# EAGLE design BB-shield-adapter (EAGLE 7.5.0)
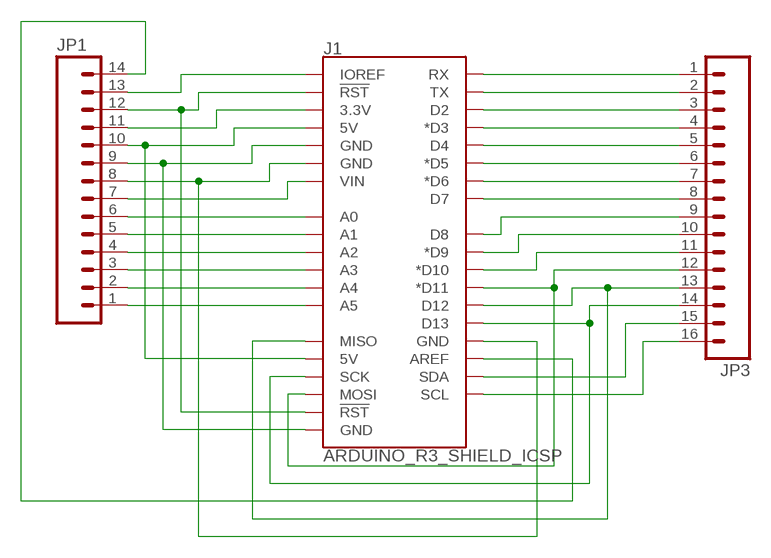
[diagram p0: schematic, sheet 1]

## Parts
J1  ARDUINO_R3_SHIELD_ICSP  [UNO_R3_SHIELD_ICSP]
JP1  M14  [1X14]
JP3  M16PTH  [1X16]

## Nets
N$1: J1.A5 JP1.1
N$2: J1.A4 JP1.2
N$3: J1.A3 JP1.3
N$4: J1.A2 JP1.4
N$5: J1.A1 JP1.5
N$6: J1.A0 JP1.6
N$7: J1.VIN JP1.7
N$8: J1.GND@1(GND) J1.GND@2(GND) JP1.8
N$9: J1.GND@0(GND) J1.GND_ICSP(GND) JP1.9
N$10: J1.5V J1.5V_ICSP(5V) JP1.10
N$11: J1.3.3V JP1.11
N$12: J1.RES(!RST!) J1.RST_ICSP(!RST!) JP1.12
N$13: J1.IOREF JP1.13
N$14: J1.RX JP3.1
N$15: J1.TX JP3.2
N$16: J1.D2 JP3.3
N$17: J1.D3(*D3) JP3.4
N$18: J1.D4 JP3.5
N$19: J1.D5(*D5) JP3.6
N$20: J1.D6(*D6) JP3.7
N$21: J1.D7 JP3.8
N$22: J1.D8 JP3.9
N$23: J1.D9(*D9) JP3.10
N$24: J1.D10(*D10) JP3.11
N$25: J1.D11(*D11) J1.MOSI JP3.12
N$26: J1.D12 J1.MISO JP3.13
N$27: J1.D13 J1.SCK JP3.14
N$28: J1.AREF JP1.14
N$29: J1.SDA JP3.15
SCL: J1.SCL JP3.16

## Library data of the parts
J1 = SparkFun-Boards:ARDUINO_R3_SHIELD_ICSP: Arduino R3 Shield Footprint w/ 6-pin (2x3) ICSP Header
JP1 = SparkFun-Connectors:M14: Header 14 Standard 14-pin 0.1" header. Use with straight break away headers (SKU : PRT-00116), right angle break away headers (PRT-00553), swiss pins (PRT-00743), machine pins (PRT-00117), and female headers (PRT-00115).
JP3 = SparkFun-Connectors:M16: 1x16 .1" header

## Board
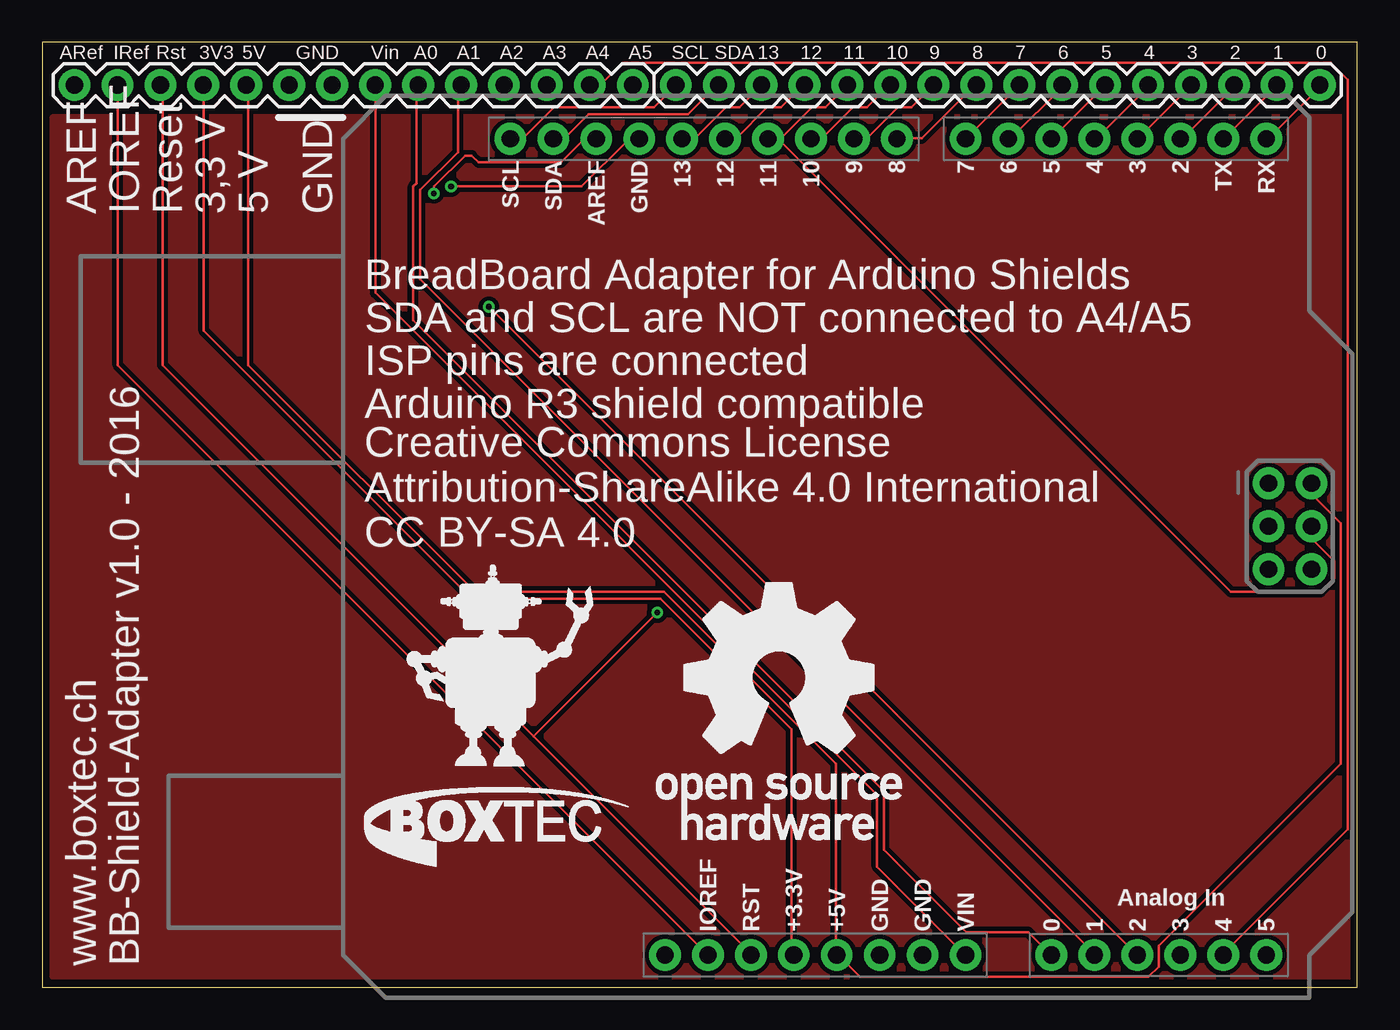
[diagram p1: board, top side]
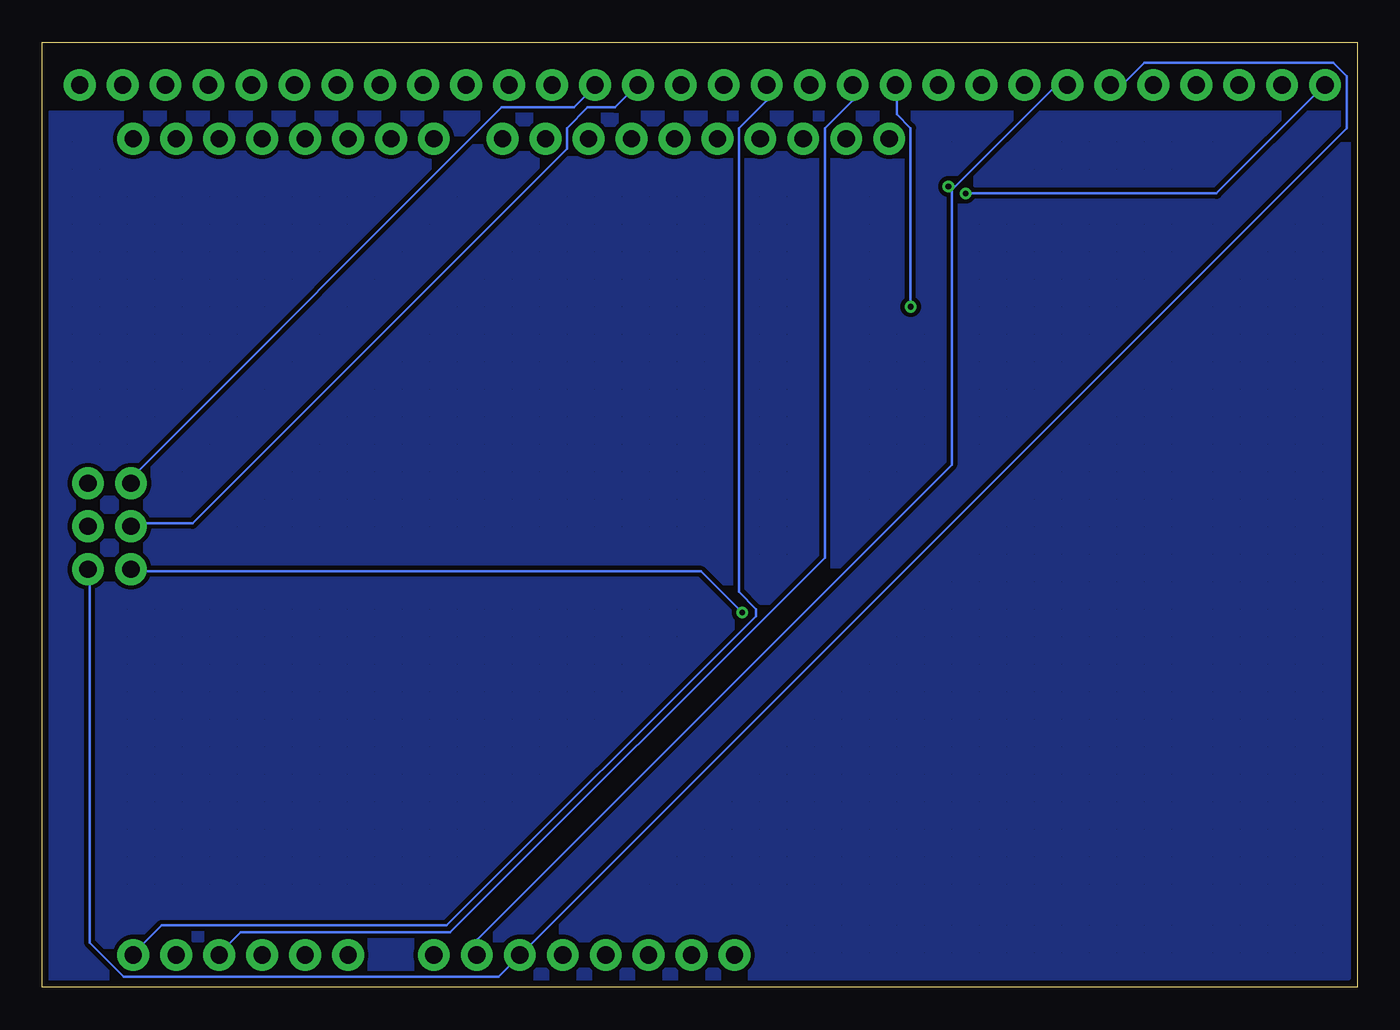
[diagram p2: board, bottom side, seen from below]

Size 77.78 x 55.87 mm. Coordinates in mm from the lower left corner, seen from the top.
Outline: 0,0 77.78,0 77.78,55.87 0,55.87 0,0
Copper layers (1*16): Top 0.0356mm / dielectric 1.5011mm / Bottom 0.0356mm
Design rules "oshpark-2layer *": minimum track width 6mil, minimum drill 13mil, track to track 10mil, track to pad 10mil, pad to pad 10mil, via to via 10mil, smd to smd 10mil, copper to edge 15mil, drill to drill 6mil, minimum pad ring 7mil, minimum via ring 7mil, stop-mask expansion 4mil, vias tented up to drill 0mil, thermal gap 10mil

### Footprints (pad centres in the part's own frame; a part is rotated, then mirrored left to right if it is on the bottom)
UNO_R3_SHIELD_ICSP = drill 1.016 pad 1.88: 3.3V 50.8,26.67; 5V 50.8,29.21; 5V_ICSP 22.91,57.29; A0 50.8,41.91; A1 50.8,44.45; A2 50.8,46.99; A3 50.8,49.53; A4 50.8,52.07; A5 50.8,54.61; AREF 2.54,14.986; D2 2.54,49.53; D3 2.54,46.99; D4 2.54,44.45; D5 2.54,41.91; D6 2.54,39.37; D7 2.54,36.83; D8 2.54,32.766; D9 2.54,30.226; D10 2.54,27.686; D11 2.54,25.146; D12 2.54,22.606; D13 2.54,20.066; GND@0 50.8,31.75; GND@1 50.8,34.29; GND@2 2.54,17.526; GND_ICSP 27.99,57.29; IOREF 50.8,21.59; MISO 22.91,54.75; MOSI 25.45,57.29; NC 50.8,19.05; RES 50.8,24.13; RST_ICSP 27.99,54.75; RX 2.54,54.61; SCK 25.45,54.75; SCL 2.54,9.906; SDA 2.54,12.446; TX 2.54,52.07; VIN 50.8,36.83
1X14 = drill 1.016 pad 1.88: 1 0,0; 2 2.54,0; 3 5.08,0; 4 7.62,0; 5 10.16,0; 6 12.7,0; 7 15.24,0; 8 17.78,0; 9 20.32,0; 10 22.86,0; 11 25.4,0; 12 27.94,0; 13 30.48,0; 14 33.02,0
1X16 = drill 1.016 pad 1.88: 1 0,0; 2 2.54,0; 3 5.08,0; 4 7.62,0; 5 10.16,0; 6 12.7,0; 7 15.24,0; 8 17.78,0; 9 20.32,0; 10 22.86,0; 11 25.4,0; 12 27.94,0; 13 30.48,0; 14 33.02,0; 15 35.56,0; 16 38.1,0

### Placement (x,y rotation side)
J1  17.78,52.7 270 top
JP1  34.92,53.34 180 top
JP3  75.56,53.34 180 top
U$1  [ROBOXTEC-LOGO-LARGE]  17.78,6.35 0 top

### Tracks (layer width: path | path; a pad name or v marks a point on that pad's centre or on a via)
N$1
  Bottom 0.152: JP1.1 34.95,53.24 34.95,52.43 36.58,50.8 36.58,23.37 35.56,22.35 35.56,21.95 53.85,3.66 70.71,3.66 72.34,2.03 J1.A5
N$2
  Top 0.152: JP1.2 32.51,53.44 33.12,53.44 34.34,54.66 76.2,54.66 77.22,53.65 77.22,9.35 69.9,2.03 J1.A4
N$3
  Bottom 0.152: JP1.3 29.87,53.24 29.87,52.43 31.5,50.8 31.5,25.4 53.65,3.25 66.04,3.25 67.26,2.03 J1.A3
N$4  (via drill 0.33)
  Top 0.152: v26.42,40.23 64.62,2.03 J1.A2
  Bottom 0.152: v26.42,40.23 26.42,50.8 27.23,51.61 27.23,53.24 JP1.4
N$5
  Top 0.152: JP1.5 24.59,53.24 24.59,49.38 22.35,47.14 22.35,41.86 62.18,2.03 J1.A1
N$6
  Top 0.152: JP1.6 22.15,53.24 22.15,47.55 21.95,47.35 21.95,39.42 49.78,11.58 49.78,8.13 54.66,3.25 58.32,3.25 59.54,2.03 J1.A0
N$7
  Top 0.152: JP1.7 19.71,53.24 19.71,41.05 49.38,11.38 49.38,7.11 54.46,2.03 J1.VIN
N$8  (via drill 0.33)
  Top 0.152: v24.18,47.35 31.9,47.35 34.54,49.99 35.15,49.99 J1.GND@2
  Bottom 0.152: 23.98,47.14 23.98,30.89 52.02,2.85 52.02,2.03 J1.GND@1 | 23.98,47.14 17.88,53.24 17.27,53.24 JP1.8 | 23.98,47.14 v24.18,47.35
N$9
  Bottom 0.152: JP1.9 14.43,53.44 13.82,53.44 12.6,54.66 1.42,54.66 0.61,53.85 0.61,50.8 49.38,2.03 J1.GND@0 49.58,1.83 50.8,0.61 72.95,0.61 74.98,2.64 74.98,24.59 J1.GND_ICSP
N$10
  Top 0.152: JP1.10 12.19,53.24 12.19,36.78 25.6,23.37 36.78,23.37 46.94,13.21 46.94,2.03 J1.5V 47.14,1.83 48.36,0.61 65.43,0.61 66.04,1.22 66.04,2.44 76.81,13.21 76.81,27.43 75.18,29.06 75.18,29.67 J1.5V_ICSP
N$11
  Top 0.152: JP1.11 9.55,53.24 9.55,38.81 25.4,22.96 36.58,22.96 44.3,15.24 44.3,2.03 J1.3.3V
N$12  (via drill 0.33)
  Top 0.152: 29.06,14.83 41.86,2.03 J1.RES | 29.06,14.83 7.11,36.78 7.11,53.24 JP1.12 | 29.06,14.83 v36.37,22.15
  Bottom 0.152: v36.37,22.15 38.81,24.59 72.34,24.59 J1.RST_ICSP
N$13
  Top 0.152: JP1.13 4.47,53.24 4.47,36.78 39.22,2.03 J1.IOREF
N$14
  Top 0.152: J1.RX 72.54,50.19 75.59,53.24 JP3.1
N$15
  Top 0.152: J1.TX 69.9,50.19 72.95,53.24 JP3.2
N$16
  Top 0.152: J1.D2 67.46,50.19 70.51,53.24 JP3.3
N$17
  Top 0.152: J1.D3 64.82,50.19 67.87,53.24 JP3.4
N$18
  Top 0.152: J1.D4 62.38,50.19 65.43,53.24 JP3.5
N$19
  Top 0.152: J1.D5 59.74,50.19 62.79,53.24 JP3.6
N$20
  Top 0.152: J1.D6 57.3,50.19 60.35,53.24 JP3.7
N$21
  Top 0.152: J1.D7 54.66,50.19 57.71,53.24 JP3.8
N$22
  Top 0.152: J1.D8 50.6,50.19 52.02,50.19 55.07,53.24 JP3.9
N$23
  Top 0.152: J1.D9 48.16,50.19 48.77,50.19 50.6,52.02 51.41,52.02 52.63,53.24 JP3.10
N$24
  Top 0.152: J1.D10 45.52,50.19 46.13,50.19 47.95,52.02 48.77,52.02 49.99,53.24 JP3.11
N$25
  Top 0.152: 43.48,50.19 43.69,50.19 45.52,52.02 46.33,52.02 47.55,53.24 JP3.12 | 43.48,50.19 43.08,50.19 J1.D11 43.48,50.19 | 43.48,50.19 70.31,23.37 75.59,23.37 76.4,24.18 76.4,25.2 75.18,26.42 75.18,27.23 J1.MOSI
N$26
  Top 0.152: J1.D12 40.44,50.19 41.05,50.19 42.88,52.02 43.69,52.02 44.91,53.24 JP3.13
  Bottom 0.152: J1.MISO 72.34,29.87 72.34,30.28 50.6,52.02 46.33,52.02 45.11,53.24 JP3.13
N$27
  Top 0.152: J1.D13 38,50.19 38.61,50.19 40.44,52.02 41.25,52.02 42.47,53.24 JP3.14
  Bottom 0.152: J1.SCK 72.34,27.43 68.89,27.43 46.74,49.58 46.74,50.8 45.52,52.02 43.89,52.02 42.67,53.24 JP3.14
N$28  (via drill 0.33)
  Top 0.152: v23.16,46.94 23.16,47.35 24.99,49.17 25.4,49.17 25.81,48.77 30.68,48.77 31.9,49.99 32.72,49.99 J1.AREF
  Bottom 0.152: v23.16,46.94 8.33,46.94 2.03,53.24 JP1.14
N$29
  Top 0.152: J1.SDA 30.28,50.19 30.89,50.19 32.31,51.61 38.2,51.61 39.83,53.24 JP3.15
N$30
  pour Bottom (hatched): 0.64,51.44 77.22,51.44 arc-90 77.47,51.18 77.47,0.64 0.89,0.64 arc-90 0.64,0.89
N$31
  pour Top: 0.64,51.44 77.47,51.44 77.47,0.64 0.64,0.64
SCL
  Top 0.152: J1.SCL 27.84,50.19 28.45,50.19 30.28,52.02 36.17,52.02 37.39,53.24 JP3.16

### Text on the board
tNames: ARef | IRef | Rst | 3V3 | 5V | GND | Vin | A0 | A1 | A2 | A3 | A4 | A5 | SCL | SDA | 13 | 12 | 11 | 10 | 9 | 8 | 7 | 6 | 5 | 4 | 3 | 2 | 1 | 0 | AREF | IOREF | Reset | 3,3 V | 5 V | GND | BreadBoard Adapter for Arduino Shields | SDA and SCL are NOT connected to A4/A5 | ISP pins are connected | Arduino R3 shield compatible | Creative Commons License / Attribution-ShareAlike 4.0 International / CC BY-SA 4.0 | www.boxtec.ch | BB-Shield-Adapter v1.0 - 2016